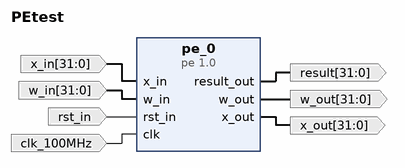
[diagram p0: block diagram of the top level]
# Vivado block design PEtest, xczu9eg-ffvb1156-2-e, Vivado 2019.1
create_bd_design PEtest

create_bd_port -dir I -type clk clk_100MHz
set_property -dict {CONFIG.FREQ_HZ 100000000} [get_bd_ports clk_100MHz]
create_bd_port -dir O -from 31 -to 0 -type data w_out
create_bd_port -dir O -from 31 -to 0 -type data x_out
create_bd_port -dir O -from 31 -to 0 -type data result
create_bd_port -dir I -from 31 -to 0 x_in
create_bd_port -dir I -from 31 -to 0 -type data w_in
create_bd_port -dir I -type data rst_in

create_bd_cell -type ip -vlnv User_Company:SysGen:pe:1.0 pe_0

# ---- connections ----

connect_bd_net [get_bd_pins pe_0/w_out] [get_bd_ports w_out]
connect_bd_net [get_bd_pins pe_0/x_out] [get_bd_ports x_out]
connect_bd_net [get_bd_pins pe_0/result_out] [get_bd_ports result]
connect_bd_net [get_bd_ports x_in] [get_bd_pins pe_0/x_in]
connect_bd_net [get_bd_ports w_in] [get_bd_pins pe_0/w_in]
connect_bd_net [get_bd_ports rst_in] [get_bd_pins pe_0/rst_in]
connect_bd_net [get_bd_ports clk_100MHz] [get_bd_pins pe_0/clk]

validate_bd_design
save_bd_design
